# EasyEDA Pro project PCB-WearableGasDetect.epro, schematic Schematic5
Create Date: 2025-02-22; Page Name: P1; Project Name: 25大创; Schematic Name: Schematic5; Update Date: 2025-02-22; Company: 嘉立创EDA; Page Size: A4; Version: V1.0
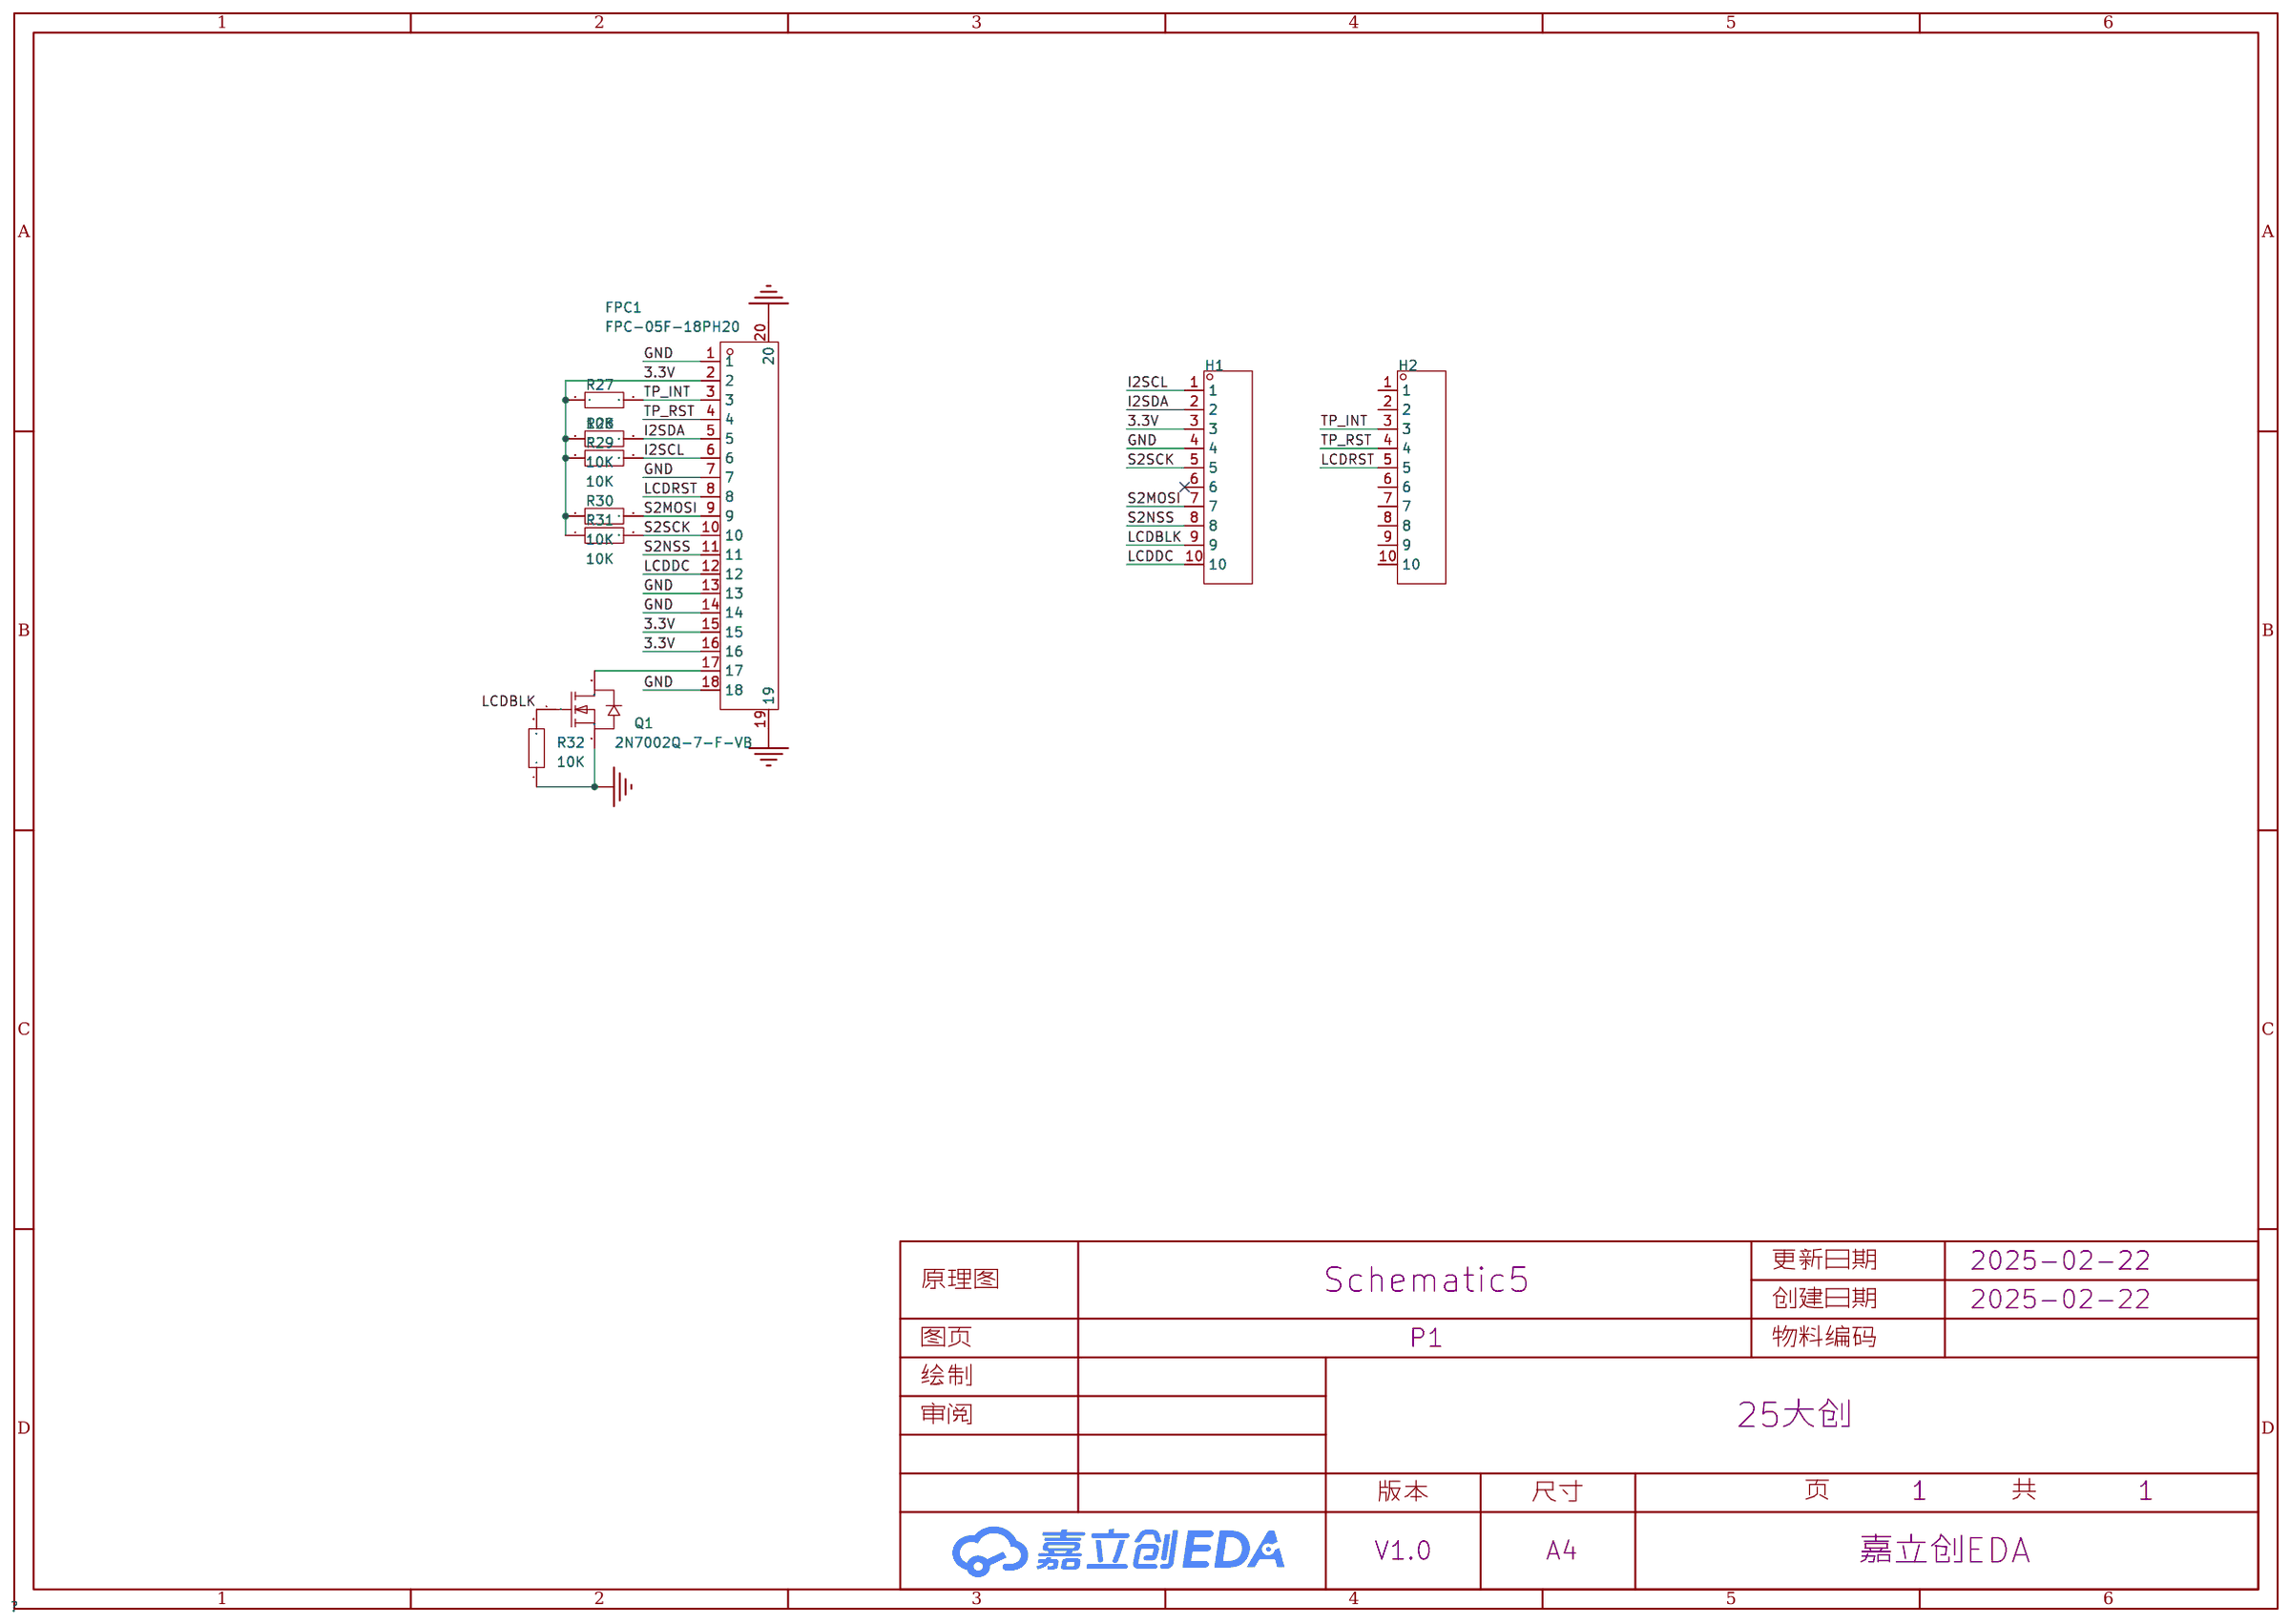
[diagram p3: schematic sheet]

## Parts
FPC1  FPC-05F-18PH20  [FPC-SMD_18P-P0.50_FPC-05F-18PH20]
H1  -  [HDR-TH_10P-P2.54-V-M-1]
H2  -  [HDR-TH_10P-P2.54-V-M-1]
Q1  2N7002Q-7-F-VB  [SOT-23-3_L2.9-W1.4-P1.90-LS2.5-BR]
R27  10K  [R0603]
R28  10K  [R0603]
R29  10K  [R0603]
R30  10K  [R0603]
R31  10K  [R0603]
R32  10K  [R0603]

## Library data of the parts
FPC1 = FPC-05F-18PH20: 锁定特性:翻盖式;触点类型:下接;触点数量:18P;间距:0.5mm;安装类型:卧贴;工作温度范围:-25℃~+85℃;; LCSC Part Name: 间距:0.5mm P数:18P 翻盖式 下接; Supplier Part: C2856802; Manufacturer: XUNPU(讯普); Supplier Footprint: SMD,P=0.5mm,卧贴; Datasheet: https://atta.szlcsc.com/upload/public/pdf/source/20210922/C2856802_2A845D1961F33AEC1ED22CECB292335F.pdf; Supplier: LCSC; Locking Feature: 翻盖式; Contact Type: 下接; Number of Contacts: 18P; Pitch: 0.5mm; Mounting Type: 卧贴; FFC, FCB Thickness: 0.3mm; Height Above Board: 2mm; Operating Temperature Range: -25℃~+85℃
H1 H2 = HDR-M_2.54_1x10P: Supplier Part: C57369; Supplier Footprint: 插件
Q1 = 2N7002Q-7-F-VB: 类型:1个N沟道;漏源电压(Vdss):60V;连续漏极电流(Id):250mA;导通电阻(RDS(on)@Vgs,Id):-;功率(Pd):300mW;阈值电压(Vgs(th)@Id):2.5V@250uA;; LCSC Part Name: 1个N沟道 耐压:60V 电流:250mA; Supplier Part: C7525052; Manufacturer: VBsemi(微碧半导体); Supplier Footprint: SOT-23; JLCPCB Part Class: 扩展库; Datasheet: https://atta.szlcsc.com/upload/public/pdf/source/20240805/684F38D9FB1B3C1C5956752768C211FC.pdf; Supplier: LCSC; Type: 1个N沟道; Drain Source Voltage (Vdss): 60V; Continuous Drain Current (Id): 250mA; Power Dissipation (Pd): 300mW; Gate Threshold Voltage (Vgs(th)@Id): 2.5V@250uA; Total Gate Charge (Qg@Vgs): 400pC@4.5V; Input Capacitance (Ciss@Vds): 25pF@25V; Reverse Transfer Capacitance (Crss@Vds): 2pF@25V; Operating Temperature: -55℃~+150℃@(Tj)
R27-R32 = Res_0603: Supplier Footprint: 0603

## Nets
3.3V: FPC1.2 FPC1.15 FPC1.16 H1.3 R27.1 R28.1 R29.1 R30.1 R31.1
GND: FPC1.1 FPC1.7 FPC1.13 FPC1.14 FPC1.18 FPC1.19 FPC1.20 H1.4 Q1.2(S) R32.1
I2SCL: FPC1.6 H1.1 R29.2
I2SDA: FPC1.5 H1.2 R28.2
LCDBLK: H1.9 Q1.1(G) R32.2
LCDDC: FPC1.12 H1.10
LCDRST: FPC1.8 H2.5
S2MOSI: FPC1.9 H1.7 R30.2
S2NSS: FPC1.11 H1.8
S2SCK: FPC1.10 H1.5 R31.2
TP_INT: FPC1.3 H2.3 R27.2
TP_RST: FPC1.4 H2.4
$1N386: FPC1.17 Q1.3(D)

Not connected (* = marked no-connect by the designer): H1 6*; H2 1 2 6 7 8 9 10
